# EasyEDA Pro project ProDoc_TP4056_2025-08-24.epro

# Schematic TP4056
Board Name: TP4056; Create Date: 2025-04-17; Page Name: TP4056; Project Name: TP4056_Module; Schematic Name: TP4056; Update Date: 2025-05-04; Add into BOM: yes; Convert to PCB: yes; Date: 2019-01-10; Draw By: Little_Arc; REV: 1.0; Sheet: 1/1; spicePre: .
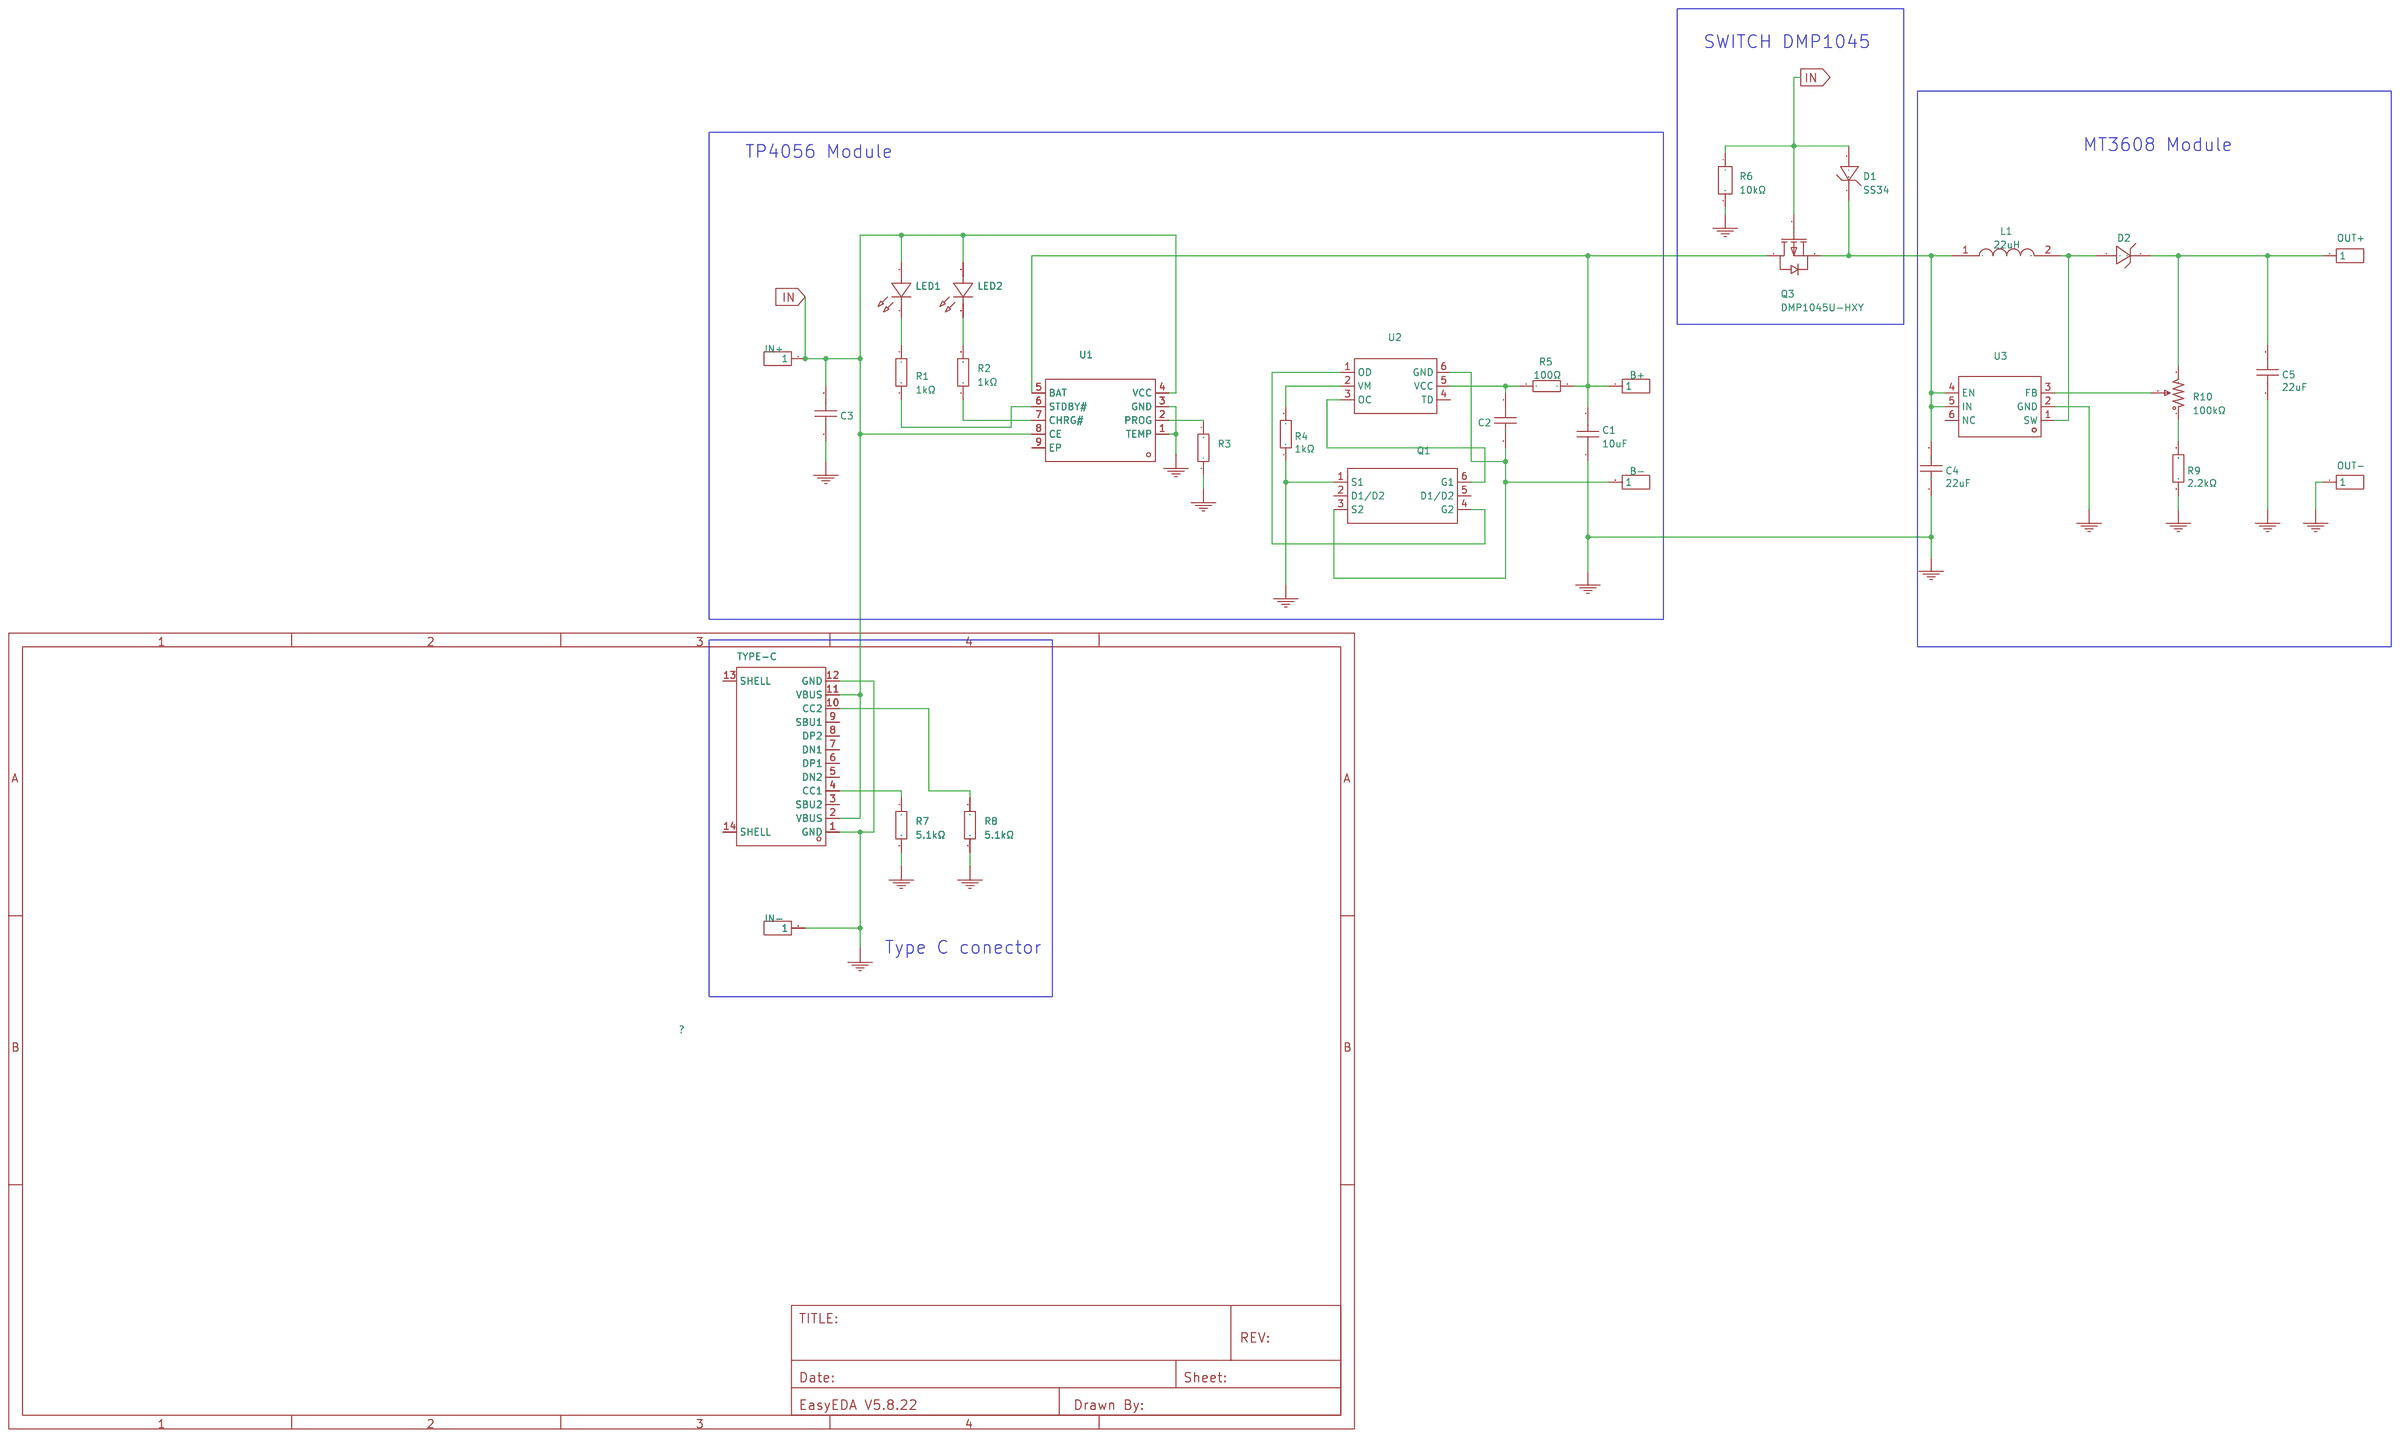
[diagram p0: schematic sheet]

## Parts
B+  Header-Male-2.54_1x1  [HDR-1X1/2.54]
B-  Header-Male-2.54_1x1  [HDR-1X1/2.54]
C1  10uF  [C0603]
C2  100nF  [C0603]
C3  100nF  [C0603]
C4  22uF  [C1206]
C5  22uF  [C1206]
D1  SS34  [SMB_L4.3-W3.6-LS5.3-RD]
D2  SS34  [SMB_L4.3-W3.6-LS5.3-RD]
IN+  Header-Male-2.54_1x1  [HDR-1X1/2.54]
IN-  Header-Male-2.54_1x1  [HDR-1X1/2.54]
L1  22uH  [IND-SMD_L7.8-W7.0_GCD75]
LED1  A-SP192DGHC-C01-4T  [LED0603-FD]
LED2  XL-1608SURC-06  [LED0603-RD_RED]
OUT+  Header-Male-2.54_1x1  [HDR-1X1/2.54]
OUT-  Header-Male-2.54_1x1  [HDR-1X1/2.54]
Q1  FS8205A  [SOT-23-6_L2.9-W1.6-P0.95-LS2.8-BR]
Q3  DMP1045U-HXY  [SOT-23-3_L2.9-W1.5-P1.90-LS2.6-BR]
R1  1kΩ  [R0603]
R2  1kΩ  [R0603]
R3  1.2kΩ  [R0603]
R4  1kΩ  [R0603]
R5  100Ω  [R0402]
R6  10kΩ  [R0603]
R7  5.1kΩ  [R0603]
R8  5.1kΩ  [R0603]
R9  2.2kΩ  [R0603]
R10  100kΩ  [RES-ADJ-TH_3296P]
TYPE-C  TYPE-C 16PIN 2MD(073)  [USB-C-SMD_TYPE-C-6PIN-2MD-073]
U1  TP4056  [ESOP-8_L4.9-W3.9-P1.27-LS6.0-BL-EP]
U2  DW01A  [SOT-23-6_L2.9-W1.6-P0.95-LS2.8-BL]
U3  MT3608  [SOT-23-6_L2.9-W1.6-P0.95-LS2.8-BL]

## Library data of the parts
B+ B- IN+ IN- OUT+ OUT- = Header-Male-2.54_1x1: Supplier Part: C81276; Supplier: LCSC; Manufacturer: ReliaPro; spicePre: P
C1 = 0603X106K100CT: Capacitance:10uF Tolerance:±10% Tolerance:±10% Voltage Rating:- Temperature Coefficient:X5R; LCSC Part Name: 10uF ±10%; Supplier Part: C2840513; Manufacturer: Walsin(华新科); Supplier Footprint: 0603; JLCPCB Part Class: Extended Part; Datasheet: https://atta.szlcsc.com/upload/public/pdf/source/20210707/C2840513_FC43A2A62BF29FBE407BBABA9C1F0793.pdf; Supplier: LCSC; Tolerance: ±10%; Temperature Coefficient: X5R
C2 C3 = CC0603KRX7R9BB104: Capacitance: Tolerance:±10% Tolerance:±10% Voltage Rated: Temperature Coefficient:; LCSC Part Name: 100nF ±10% 50V; Supplier Part: C14663; Manufacturer: YAGEO(国巨); Supplier Footprint: 0603; JLCPCB Part Class: Basic Part; Datasheet: https://atta.szlcsc.com/upload/public/pdf/source/20180910/C282072_33301C7F631E79921B82A8DAC6BCC5B3.pdf; Supplier: LCSC; Tolerance: ±10%
C4 C5 = C1206X6S226M250NT: Capacitance:22uF Voltage Rating:25V Temperature Coefficient:-; LCSC Part Name: 22uF 25V; Supplier Part: C2835562; Manufacturer: SANYEAR(叁叶源); Supplier Footprint: 1206; JLCPCB Part Class: Extended Part; Datasheet: https://atta.szlcsc.com/upload/public/pdf/source/20211010/C2835566_14A0738C7D65B521DA1087F759FD87A4.pdf; Supplier: LCSC; Voltage Rating: 25V
D1 D2 = SS34_C3040628: Supplier Part: C3040628; Manufacturer: TECH PUBLIC(台舟); Supplier Footprint: SMA(DO-214AC); JLCPCB Part Class: Extended Part; Datasheet: https://atta.szlcsc.com/upload/public/pdf/source/20220721/42DFBCCF71D5E6F935D4D44D6D405D19.pdf; Supplier: LCSC
L1 = CY75-22UH: Inductance: Tolerance:±10% Tolerance:±10% Rated Current: Saturation Current (Isat):- DC Resistance (DCR): Q @ Freq:- Frequency - Self Resonant:- Ratings:; LCSC Part Name: 22uH ±10%; Supplier Part: C2929439; Manufacturer: SHOU HAN(首韩); Supplier Footprint: SMD,7.8x7mm; JLCPCB Part Class: Extended Part; Datasheet: https://atta.szlcsc.com/upload/public/pdf/source/20211213/9D59673C46388054D2E0A5C760F25837.pdf; Supplier: LCSC; Tolerance: ±10%
LED1 = A-SP192DGHC-C01-4T: Emitted Color:Green Forward Voltage (VF):2.4V~3V Forward Voltage (VF):2.4V~3V Power Dissipation:70mW Dominant Wavelength:520nm~535nm Dominant Wavelength:520nm~535nm Lens Color:Colorless Transparent Lens Luminous Intensity:225mcd~450mcd Luminous Intensity:; LCSC Part Name: 0603高亮绿灯正贴; Supplier Part: C19171301; Manufacturer: Amicc(欧密格光电); Supplier Footprint: 0603; JLCPCB Part Class: Extended Part; Datasheet: https://atta.szlcsc.com/upload/public/pdf/source/20231108/CAA90604E374CB6B31BBE970B55159E7.pdf; Supplier: LCSC; Emitted Color: Green; Forward Voltage (VF): 2.4V~3V; Power Dissipation: 70mW; Dominant Wavelength: 520nm~535nm; Lens Color: Colorless Transparent Lens; Luminous Intensity: 225mcd~450mcd; Viewing Angle: 120°; Mounting Sytle: Positive Stick; Operating Temperature: -40℃~+85℃
LED2 = XL-1608SURC-06: Lamp Holder Type:- Illumination Color:Red Voltage - Forward(Vf):2.3V Voltage - Forward(Vf):2.3V Power(Watts):50mW Forward Current:20mA Wavelength - Dominant:620nm~630nm Wavelength - Dominant:620nm~630nm Peak Wavelength:625nm Diode Configuration:- Lens Col; Supplier Part: C965799; Manufacturer: XINGLIGHT(成兴光); Supplier Footprint: 0603; JLCPCB Part Class: Extended Part; Datasheet: https://atta.szlcsc.com/upload/public/pdf/source/20250213/F9766CE804AF391355DCDD48DB3E0DAB.pdf; Supplier: LCSC; Illumination Color: Red; Voltage - Forward(Vf): 2.3V; Power(Watts): 50mW; Forward Current: 20mA; Wavelength - Dominant: 620nm~630nm; Peak Wavelength: 625nm; Lens Color: Colorless Transparent Lens; Luminous Intensity: 225mcd; Viewing Angle: 120°; Mounting Sytle: Positive Stick; Operating Temperature: -20℃~+85℃
Q1 = FS8205A_C908265: Type:2 N-Channel Drain to Source Voltage:20V Current - Continuous Drain(Id): RDS(on):18mΩ@4.5V,6A Pd - Power Dissipation:1.5W Gate Threshold Voltage (Vgs(th)@Id):1.2V Gate Charge(Qg):11nC@4.5V Input Capacitance(Ciss@Vds):800pF@8V Reverse Transfer Capacita; LCSC Part Name: 2个N沟道 耐压:20V 电流:6A; Supplier Part: C908265; Manufacturer: FUXINSEMI(富芯森美); Supplier Footprint: SOT-23-6L; JLCPCB Part Class: Extended Part; Datasheet: https://atta.szlcsc.com/upload/public/pdf/source/20201027/C908265_C6F1A5E0FB14735EF799FEF607A99450.pdf; Supplier: LCSC; Type: 2 N-Channel; Drain to Source Voltage: 20V; RDS(on): 18mΩ@4.5V,6A; Pd - Power Dissipation: 1.5W; Gate Threshold Voltage (Vgs(th)@Id): 1.2V; Gate Charge(Qg): 11nC@4.5V; Input Capacitance(Ciss@Vds): 800pF@8V; Reverse Transfer Capacitance (Crss@Vds): 125pF@8V; Operating Temperature: -55℃~+150℃@(Tj)
Q3 = DMP1045U-HXY: Type:1 piece P-channel Drain to Source Voltage:20V Current - Continuous Drain(Id):5A RDS(on):-; LCSC Part Name: 1个P沟道 耐压:20V 电流:5A; Supplier Part: C22366440; Manufacturer: HXY MOSFET(华轩阳电子); Supplier Footprint: SOT-23; JLCPCB Part Class: Extended Part; Datasheet: https://atta.szlcsc.com/upload/public/pdf/source/20240325/BFE8E9B09D2639D7EAC9A471C7F13AD0.pdf; Supplier: LCSC; Type: 1 piece P-channel; Drain to Source Voltage: 20V; Current - Continuous Drain(Id): 5A
R1 R2 R4 = RC0603FR-071KL: Type:Thick Film Resistors Resistance: Tolerance:±1% Tolerance:±1% Power(Watts): Overload Voltage (Max): Temperature Coefficient:±100ppm/℃ Temperature Coefficient:±100ppm/℃ Operating Temperature Range:-55℃~+155℃ Operating Temperature Range:-55℃~+155℃; LCSC Part Name: 厚膜电阻 1kΩ ±1% 100mW; Supplier Part: C22548; Manufacturer: YAGEO(国巨); Supplier Footprint: 0603; JLCPCB Part Class: Extended Part; Datasheet: https://atta.szlcsc.com/upload/public/pdf/source/20180316/70C0E2BDAE7FCC62C531A5A58D202EE1.pdf; Supplier: LCSC; Type: Thick Film Resistors; Tolerance: ±1%; Temperature Coefficient: ±100ppm/℃; Operating Temperature Range: -55℃~+155℃
R3 = RMC06031.2K5%N: Resistance: Tolerance:±5% Tolerance:±5% Power(Watts):; LCSC Part Name: 1.2kΩ ±5% 100mW; Supplier Part: C269681; Manufacturer: Tyohm(幸亚电阻); Supplier Footprint: 0603; JLCPCB Part Class: Extended Part; Datasheet: https://atta.szlcsc.com/upload/public/pdf/source/20190115/C325956_D27151D492FFB3C9AB4A6F14FE01F30A.pdf; Supplier: LCSC; Tolerance: ±5%
R5 = TR0402B100RQ1050Z: Type:Thin Film Resistor Resistance: Tolerance:±0.1% Tolerance:±0.1% Power(Watts): Overload Voltage (Max): Temperature Coefficient:±50ppm/℃ Temperature Coefficient:±50ppm/℃ Operating Temperature Range:-55℃~+155℃ Operating Temperature Range:-55℃~+155℃; LCSC Part Name: 薄膜电阻 100Ω ±0.1% 63mW; Supplier Part: C332259; Manufacturer: EVER OHMS(天二科技); Supplier Footprint: 0402; JLCPCB Part Class: Extended Part; Datasheet: https://atta.szlcsc.com/upload/public/pdf/source/20190527/C149900_32B1354086E9F6A772108AB7B2B7A514.pdf; Supplier: LCSC; Type: Thin Film Resistor; Tolerance: ±0.1%; Temperature Coefficient: ±50ppm/℃; Operating Temperature Range: -55℃~+155℃
R6 = FRC0603J103 TS: Type:Thick Film Resistors Resistance:10kΩ Tolerance:±5% Tolerance:±5% Power(Watts):0.1W Voltage-Supply(Max):75V Temperature Coefficient:±100ppm/℃ Temperature Coefficient:±100ppm/℃ Operating Temperature:-55℃~+155℃ Operating Temperature:-55℃~+155℃; LCSC Part Name: 10kΩ ±5% 100mW 厚膜电阻; Supplier Part: C2930027; Manufacturer: FOJAN(富捷); Supplier Footprint: 0603; JLCPCB Part Class: Extended Part; Datasheet: https://atta.szlcsc.com/upload/public/pdf/source/20211221/925EC7D7225764EE0046F22065062C87.pdf; Supplier: LCSC; Type: Thick Film Resistors; Tolerance: ±5%; Power(Watts): 0.1W; Voltage-Supply(Max): 75V; Temperature Coefficient: ±100ppm/℃; Operating Temperature: -55℃~+155℃
R7 R8 = 0603WAF5101T5E: Type:Thick Film Resistors Resistance:5.1kΩ Tolerance:±1% Tolerance:±1% Power(Watts): Overload Voltage (Max): Temperature Coefficient:±100ppm/℃ Temperature Coefficient:±100ppm/℃ Operating Temperature Range:-55℃~+155℃ Operating Temperature Range:-55℃~+155℃; LCSC Part Name: 5.1kΩ ±1% 100mW 厚膜电阻; Supplier Part: C23186; Manufacturer: UNI-ROYAL(厚声); Supplier Footprint: 0603; JLCPCB Part Class: Basic Part; Datasheet: https://atta.szlcsc.com/upload/public/pdf/source/20200306/C422600_1E6D84923E4A46A82E41ADD87F860B5C.pdf; Supplier: LCSC; Type: Thick Film Resistors; Tolerance: ±1%; Temperature Coefficient: ±100ppm/℃; Operating Temperature Range: -55℃~+155℃
R9 = 0603WAF2201T5E_C4190: Type:Thick Film Resistors Resistance:2.2kΩ Tolerance:±1% Tolerance:±1% Power(Watts): Overload Voltage (Max): Temperature Coefficient:±100ppm/℃ Temperature Coefficient:±100ppm/℃ Operating Temperature Range:-55℃~+155℃ Operating Temperature Range:-55℃~+155℃; LCSC Part Name: 2.2kΩ ±1% 100mW 厚膜电阻; Supplier Part: C4190; Manufacturer: UNI-ROYAL(厚声); Manufacturer Part: 0603WAF2201T5E; Supplier Footprint: 0603; JLCPCB Part Class: Basic Part; Datasheet: https://atta.szlcsc.com/upload/public/pdf/source/20200306/C422600_1E6D84923E4A46A82E41ADD87F860B5C.pdf; Supplier: LCSC; Type: Thick Film Resistors; Tolerance: ±1%; Temperature Coefficient: ±100ppm/℃; Operating Temperature Range: -55℃~+155℃
R10 = 3296P-1-104LF: Resistance: Tolerance:±10% Tolerance:±10% Power(Watts):500mW Temperature Coefficient:±100ppm/℃ Temperature Coefficient:±100ppm/℃ Turns:; LCSC Part Name: 100kΩ ±10%; Supplier Part: C780112; Manufacturer: BOURNS; Supplier Footprint: 插件-3P,9.5x4.8mm; JLCPCB Part Class: Extended Part; Datasheet: https://atta.szlcsc.com/upload/public/pdf/source/20200907/C780107_B10DBBD0C4B43BFA1FDAF98D4F88F255.pdf; Supplier: LCSC; Tolerance: ±10%; Power(Watts): 500mW; Temperature Coefficient: ±100ppm/℃
TYPE-C = TYPE-C 16PIN 2MD(073): Connector Type:Type-C Standard:USB 3.1 Gender:Female Mounting Style:Horizontal attachment Number of Contacts:16P Number of Ports:1 Current Rating - Power (Max):5A Operating Temperature Range:-25℃~+85℃ Operating Temperature Range:-25℃~+85℃ Rated Voltage (M; LCSC Part Name: Type-C 母 卧贴; Supplier Part: C2765186; Manufacturer: SHOU HAN(首韩); Supplier Footprint: SMD; JLCPCB Part Class: Extended Part; Datasheet: https://atta.szlcsc.com/upload/public/pdf/source/20211123/39B17C16241EAC15C5E277BDA434118E.pdf; Supplier: LCSC; Connector Type: Type-C; Standard: USB 3.1; Gender: Female; Mounting Style: Horizontal attachment; Number of Contacts: 16P; Number of Ports: 1; Current Rating - Power (Max): 5A; Operating Temperature Range: -25℃~+85℃; Rated Voltage (Max): 5V; Connect-Disconnect Life: 5000 Cuts; Core Colour: Black
U1 = TP4056_C382139: The Chip Type:Linear charging chip Supply Voltage:4V~6V Supply Voltage:4V~6V Maximum Charge Current:1A Charging Saturation Voltage:4.2V Type of Battery:Lithium-ion/Polymer Number of Cells:1 Number of Cells:1 Operating Temperature:-40℃~+85℃ Operating Tempe; LCSC Part Name: 1A锂电池充电IC; Supplier Part: C382139; Manufacturer: TPOWER(天源); Supplier Footprint: ESOP-8; JLCPCB Part Class: Extended Part; Datasheet: https://atta.szlcsc.com/upload/public/pdf/source/20190327/C382139_EC85960E6FE3E26856C240C81751A184.pdf; Supplier: LCSC; The Chip Type: Linear charging chip; Supply Voltage: 4V~6V; Maximum Charge Current: 1A; Charging Saturation Voltage: 4.2V; Type of Battery: Lithium-ion/Polymer; Number of Cells: 1; Operating Temperature: -40℃~+85℃
U2 = DW01A_C351410: Supplier Part: C351410; Manufacturer: PUOLOP(迪浦); Supplier Footprint: SOT-23-6L; JLCPCB Part Class: Extended Part; Datasheet: https://atta.szlcsc.com/upload/public/pdf/source/20190109/C351410_3E9B9491D1909DF24C48D1B9CD871392.pdf; Supplier: LCSC
U3 = MT3608: Function:Boost type Output Type:Adjustable Input Voltage:2V~24V Input Voltage:2V~24V Output Voltage:28V Output Voltage:28V Output Current:2A Switching Frequency:1.2MHz Switching Frequency:1.2MHz Operating Temperature:-40℃~+85℃ Operating Temperature:-40℃~+; LCSC Part Name: 高效1.2MHz 2A升压转换器; Supplier Part: C84817; Manufacturer: 西安航天民芯; Supplier Footprint: SOT-23-6; JLCPCB Part Class: Extended Part; Datasheet: https://atta.szlcsc.com/upload/public/pdf/source/20161110/1478743351706.pdf; Supplier: LCSC; Function: Boost type; Output Type: Adjustable; Input Voltage: 2V~24V; Output Voltage: 28V; Output Current: 2A; Switching Frequency: 1.2MHz; Operating Temperature: -40℃~+85℃; Synchronous Rectification: No; Number of Outputs: 1; Topology: Boost; Quiescent Current (Iq): 200uA; Switch tube (built-in/external): Built-in

## Nets
GND: C1.1 C3.1 C4.1 C5.1 IN-.1 OUT-.1 Q1.1(S1) R3.2 R4.1 R6.2 R7.2 R8.2 R9.1 TYPE-C.1(GND) TYPE-C.12(GND) U1.1(TEMP) U1.3(GND) U3.2(GND)
VCC_DW01A: C2.1 R5.1 U2.5(VCC)
BAT+: B+.1 C1.2 Q3.3(D) R5.2 U1.5(BAT)
BAT-: B-.1 C2.2 Q1.3(S2) U2.6(GND)
CC1: R7.1 TYPE-C.4(CC1)
CC2: R8.1 TYPE-C.10(CC2)
CHRG: R2.1 U1.7(CHRG#)
FB: R10.2 U3.3(FB)
IN: C3.2 D1.2(A) IN+.1 LED1.2(A) LED2.2(A) Q3.1(G) R6.1 TYPE-C.2(VBUS) TYPE-C.11(VBUS) U1.4(VCC) U1.8(CE)
IN_MT3608: C4.2 D1.1(C) L1.1 Q3.2(S) U3.4(EN) U3.5(IN)
OC: Q1.6(G1) U2.3(OC)
OD: Q1.4(G2) U2.1(OD)
OUT+: C5.2 D2.1(C) OUT+.1 R10.3
PROG: R3.1 U1.2(PROG)
STDBY: R1.2 U1.6(STDBY#)
SW: D2.2(A) L1.2 U3.1(SW)
VM: R4.2 U2.2(VM)
$1N5: LED1.1(K) R1.1
$1N6: LED2.1(K) R2.2
$1N2970: R9.2 R10.1

Not connected (* = marked no-connect by the designer): Q1 2(D1/D2) 5(D1/D2); TYPE-C 3(SBU2) 5(DN2) 6(DP1) 7(DN1) 8(DP2) 9(SBU1) 13(SHELL) 14(SHELL); U1 9(EP); U2 4(TD); U3 6(NC)

## Notes on the sheet
- SWITCH DMP1045
- MT3608 Module
- TP4056 Module
- Type C conector

# Board TP4056
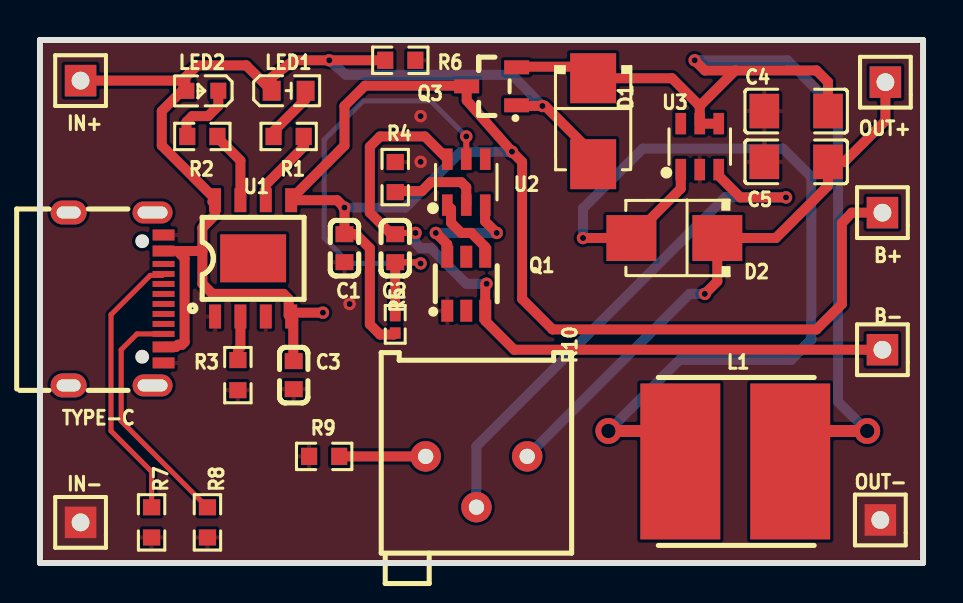
[diagram p1: board, top side]
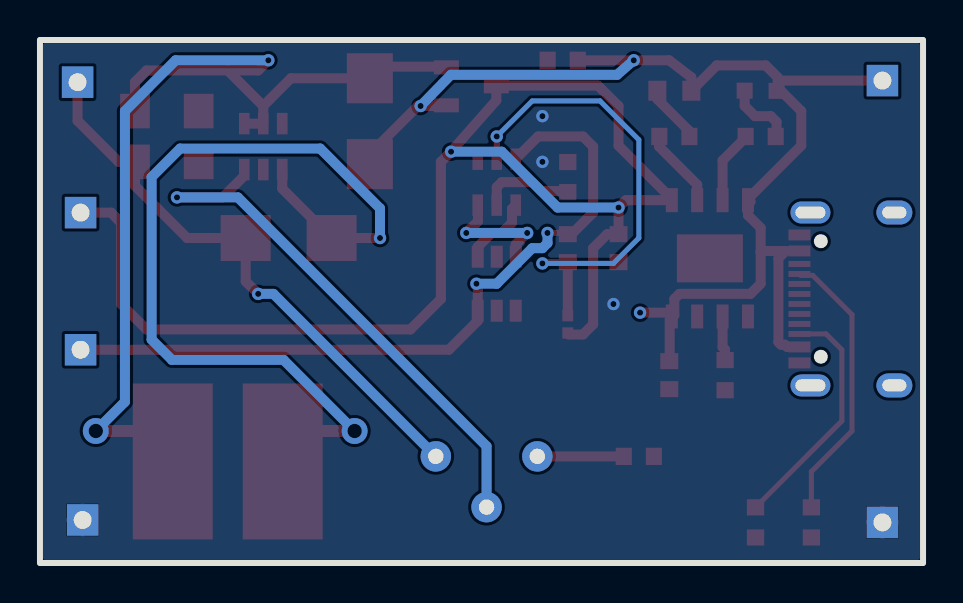
[diagram p2: board, bottom side, seen from below]

Outline 44.2 x 26.16 mm; copper layers: Top Layer, Bottom Layer. Coordinates in mm from the lower left corner of the outline.
Outline path: 0,26.16 44.2,26.16 44.2,0 0,0 0,26.16
Stack: Top Layer 0.035mm / Dielectric1 1.51mm FR4 er 4.5 / Bottom Layer 0.035mm

## Design rules (mm)
spacing Default (default): track to track 0.152, other pairs 0 to 0.152
track width Default (default): min 0.152, default 0.152, max 25.4
differential pair differentialPair (default): width min 0.127, default 0.254, max 2.54; gap min 0.152, default 0.152
via Default (default): diameter min 0.61, default 0.61, max 100.025; hole min 0.305, default 0.305, max 59.995
pour e100 uses (1)

## Placement (name value [footprint] x y rotation side)
B+  Header-Male-2.54_1x1  [HDR-1X1/2.54]  42.16 17.53 0 top
B-  Header-Male-2.54_1x1  [HDR-1X1/2.54]  42.16 10.67 0 top
C1  10uF  [C0603]  15.24 15.75 90 top
C2  100nF  [C0603]  17.78 15.75 90 top
C3  100nF  [C0603]  12.7 9.4 90 top
C4  22uF  [C1206]  37.85 22.61 0 top
C5  22uF  [C1206]  37.85 20.07 0 top
D1  SS34  [SMB_L4.3-W3.6-LS5.3-RD]  27.69 22.1 270 top
D2  SS34  [SMB_L4.3-W3.6-LS5.3-RD]  31.75 16.26 180 top
IN+  Header-Male-2.54_1x1  [HDR-1X1/2.54]  2.03 24.13 0 top
IN-  Header-Male-2.54_1x1  [HDR-1X1/2.54]  2.03 2.03 0 top
L1  22uH  [IND-SMD_L7.8-W7.0_GCD75]  34.8 5.08 180 top
LED1  A-SP192DGHC-C01-4T  [LED0603-FD]  12.45 23.62 180 top
LED2  XL-1608SURC-06  [LED0603-RD_RED]  8.13 23.62 180 top
OUT+  Header-Male-2.54_1x1  [HDR-1X1/2.54]  42.31 24.05 0 top
OUT-  Header-Male-2.54_1x1  [HDR-1X1/2.54]  42.06 2.15 0 top
Q1  FS8205A  [SOT-23-6_L2.9-W1.6-P0.95-LS2.8-BR]  21.34 13.97 270 top
Q3  DMP1045U-HXY  [SOT-23-3_L2.9-W1.5-P1.90-LS2.6-BR]  22.61 23.84 0 top
R1  1kΩ  [R0603]  12.45 21.34 0 top
R2  1kΩ  [R0603]  8.13 21.34 180 top
R3  1.2kΩ  [R0603]  9.91 9.4 270 top
R4  1kΩ  [R0603]  17.78 19.3 270 top
R5  100Ω  [R0402]  17.78 11.94 270 top
R6  10kΩ  [R0603]  18.03 25.15 0 top
R7  5.1kΩ  [R0603]  5.59 2.03 270 top
R8  5.1kΩ  [R0603]  8.38 2.03 270 top
R9  2.2kΩ  [R0603]  14.22 5.33 0 top
R10  100kΩ  [RES-ADJ-TH_3296P]  21.84 4.06 270 top
TYPE-C  TYPE-C 16PIN 2MD(073)  [USB-C-SMD_TYPE-C-6PIN-2MD-073]  3.81 13.21 270 top
U1  TP4056  [ESOP-8_L4.9-W3.9-P1.27-LS6.0-BL-EP]  10.67 15.24 0 top
U2  DW01A  [SOT-23-6_L2.9-W1.6-P0.95-LS2.8-BL]  21.34 19.05 0 top
U3  MT3608  [SOT-23-6_L2.9-W1.6-P0.95-LS2.8-BL]  33.02 20.83 0 top

## Footprints (pads in the part's own frame, mm; a bottom-side part is the same pattern mirrored in y, then rotated)
C0603
  rect 0.8x0.9 smd: 1(-0.7,0) 2(0.7,0)
C1206
  rect 1.485x1.728 smd: 1(-1.593,0) 2(1.593,0)
ESOP-8_L4.9-W3.9-P1.27-LS6.0-BL-EP
  rect 0.6x1.2 smd: 1(-1.905,-2.909) 2(-0.635,-2.909) 3(0.635,-2.909) 4(1.905,-2.909) 5(1.905,2.909) 6(0.635,2.909) 7(-0.635,2.909) 8(-1.905,2.909)
  rect 3.3x2.4 smd: 9(0,0)
HDR-1X1/2.54
  rect 1.575x1.575 hole 0.889: 1(0,0)
IND-SMD_L7.8-W7.0_GCD75
  rect 4x7.8 smd: 1(-2.75,0) 2(2.75,0)
LED0603-FD
  rect 0.9x1 smd: 1(-0.85,0) 2(0.85,0)
LED0603-RD_RED
  rect 0.8x0.8 smd: 1(-0.799,-0.004) 2(0.799,0.004)
R0402
  rect 0.566x0.54 smd: 1(-0.433,0) 2(0.433,0)
R0603
  rect 0.806x0.864 smd: 1(-0.753,0) 2(0.753,0)
RES-ADJ-TH_3296P
  round 1.524 hole 0.762: 1(-1.27,-2.54) 2(1.27,0) 3(-1.27,2.54)
SMB_L4.3-W3.6-LS5.3-RD
  rect 2.5x2.3 smd: 1(-2.15,0) 2(2.15,0)
SOT-23-3_L2.9-W1.5-P1.90-LS2.6-BR
  rect 1.25x0.7 smd: 1(1.25,-0.95) 2(1.25,0.95) 3(-1.25,0)
SOT-23-6_L2.9-W1.6-P0.95-LS2.8-BL
  rect 0.532x1.072 smd: 1(-0.95,-1.149) 2(0,-1.149) 3(0.95,-1.149) 4(0.95,1.149) 5(0,1.149) 6(-0.95,1.149)
SOT-23-6_L2.9-W1.6-P0.95-LS2.8-BR
  rect 1.1x0.6 smd: 1(1.35,-0.95) 2(1.35,0) 3(1.35,0.95) 4(-1.35,0.95) 5(-1.35,0) 6(-1.35,-0.95)
USB-C-SMD_TYPE-C-6PIN-2MD-073
  rect 0.55x1.1 smd: 1(-3.2,2.375) 2(-2.4,2.375) 11(2.4,2.375) 12(3.2,2.375)
  rect 0.3x1.1 smd: 3(-1.75,2.375) 4(-1.25,2.375) 5(-0.75,2.375) 6(-0.25,2.375) 7(0.25,2.375) 8(0.75,2.375) 9(1.25,2.375) 10(1.75,2.375)
  oval 1.1x2 hole 0.6x1.5: 13(-4.325,1.825) 14(4.325,1.825)
  oval 1.2x1.8 hole 0.6x1.2: 13(-4.325,-2.375) 14(4.325,-2.375)

## Nets
As in the schematic.

Pads without a net: Q1 2 5; TYPE-C 3 5 6 7 8 9 13 14; U1 9; U2 4; U3 6

## Via types
v1: diameter 0.62, hole 0.305, Top Layer to Bottom Layer, 18 vias
v2: diameter 1.3, hole 0.72, Top Layer to Bottom Layer, 2 vias

## Routing (per net, layer and track width the routed paths; a pad name or vN(x,y) marks a point on that pad's centre or on a via; arc(x,y) is an arc through that point)
GND:
  vias: v1(15.49,12.95) v1(19.05,22.35) v1(19.05,20.07)
VCC_DW01A: length 24
  Top Layer w0.3: v1(21.34,21.34) 21.34,20.21 ; C2.1 18.99,15.05 v1(19.05,14.99)
  Top Layer w0.5: C2.1 R5.1
  Bottom Layer w0.254: v1(19.05,14.99) 15.49,14.99 14.22,16.26 14.22,21.17 16.17,23.11 19.56,23.11 v1(21.34,21.34)
BAT+: length 68
  Top Layer w0.5: 12.57,18.21 15.24,20.88 15.24,22.86 16.27,23.88 21.36,23.88 ; U1.5 14.87,18.15 v1(15.24,17.78) C1.2 15.81,16.45 16.51,15.75 16.51,11.94 17.02,11.43 17.72,11.43 17.78,11.49 ; Q3.3 21.36,23.14 v1(23.62,20.57) 24.13,20.07 24.13,13.21 25.65,11.68 38.86,11.68 40.13,12.95 40.13,16.99 40.63,17.53 B+.1
  Bottom Layer w0.5: v1(23.62,20.57) 21.08,20.57 18.29,17.78 v1(15.24,17.78)
BAT-: length 37.9
  Top Layer w0.3: v1(18.8,16.51) 17.84,16.51 C2.2
  Top Layer w0.5: v1(22.35,13.97) 22.28,13.9 22.29,12.11 23.73,10.67 B-.1 ; 20.4,20.21 19.27,21.34 17.02,21.34 16.51,20.83 16.51,17.53 17.59,16.45 C2.2
  Bottom Layer w0.5: v1(18.8,16.51) 18.8,16 19.05,15.75 19.56,15.75 21.34,13.97 v1(22.35,13.97)
CC1: length 14
  Top Layer w0.254: TYPE-C.4 6.11,14.39 5.52,14.39 3.56,12.42 3.56,6.6 5.59,4.57 R7.1
CC2: length 12.1
  Top Layer w0.254: TYPE-C.10 4.85,11.46 4.06,10.67 4.06,7.1 R8.1
CHRG: length 3.6
  Top Layer w0.5: 10.03,18.21 10.03,20.13 8.83,21.34
FB: length 27.4
  Top Layer w0.5: 34.04,19.3 35.05,18.29 37.34,18.29
  Bottom Layer w0.5: R10.2 21.84,5.84 34.29,18.29 37.34,18.29
  vias: v1(37.34,18.29)
IN: length 62.5
  Top Layer w0.254: 6.87,15.61 TYPE-C.2
  Top Layer w0.5: v1(14.16,12.52) 12.57,12.52 ; 23.88,22.86 v1(25.15,22.86) 25.28,22.86 27.69,20.46 ; TYPE-C.11 6.8,10.81 6.92,10.92 7.11,10.92 7.24,11.05 7.24,15.24 6.87,15.61 8.09,15.61 8.13,15.57 ; 2.29,24.13 7.02,24.13 ; 8.13,15.57 8.13,13.97 8.64,13.46 12.19,13.46 12.45,13.21 12.45,12.39 12.68,12.16 12.68,10.12 C3.2 ; 8.13,15.57 8.13,16.76 8.76,17.4 8.76,18.21 ; 8.63,18.07 8.76,18.21 ; 8.76,18.21 6.1,20.88 6.1,22.61 7.28,23.79 7.28,24.3 7.87,24.89 10.33,24.89 11.59,23.62 11.59,24.3 12.71,25.15 v1(14.48,25.15) R6.1
  Bottom Layer w0.5: v1(14.48,25.15) 15.31,24.42 23.63,24.42 v1(25.15,22.86)
IN_MT3608: length 52.2
  Top Layer w0.5: 33.02,22.86 31.63,24.25 D1.1 27.11,24.83 23.86,24.83 ; 33.02,22.86 34.8,24.64 ; 33.02,22.86 U3.5 U3.4 ; v1(32.77,25.15) 33.27,24.64 34.8,24.64 ; 34.8,24.64 38.86,24.64 39.44,24.06 C4.2
  Top Layer w0.6: L1.1 39.07,6.6 v2(41.4,6.6)
  Bottom Layer w0.5: v1(32.77,25.15) 37.4,25.15 39.94,22.61 39.94,8.06 v2(41.4,6.6)
OC: length 6.1
  Top Layer w0.5: 22.28,17.89 22.28,17.09 v1(22.86,16.51) ; v1(19.81,16.51) 20.39,15.94 Q1.6
  Bottom Layer w0.5: v1(19.81,16.51) v1(22.86,16.51)
OD: length 3.7
  Top Layer w0.5: Q1.4 22.29,15.81 21.59,16.51 21.08,16.51 20.57,17.02 20.57,17.72 20.4,17.89
OUT+: length 28.6
  Top Layer w0.5: 34.04,16.26 36.83,16.26 39.44,18.86 C5.2 40.26,20.07 42.31,22.12 OUT+.1 ; D2.1 33.9,14.09 v1(33.27,13.46)
  Bottom Layer w0.5: R10.3 32.51,13.46 v1(33.27,13.46)
PROG: length 2.2
  Top Layer w0.5: 9.91,10.1 9.91,10.67 10.03,10.8 10.03,12.27
STDBY: length 3.9
  Top Layer w0.5: 11.3,18.21 11.3,18.92 13.21,20.83 13.21,21.27 13.15,21.34
SW: length 46.1
  Top Layer w0.5: v1(27.18,16.26) D2.2 32.07,18.73 U3.1
  Top Layer w0.6: v2(28.45,6.6) 30.73,6.6 30.73,6.61 L1.2
  Bottom Layer w0.5: v1(27.18,16.26) 27.18,17.74 30.17,20.73 37.18,20.73 38.61,19.3 38.61,11.18 37.59,10.16 32,10.16 v2(28.45,6.6)
VM: length 4.7
  Top Layer w0.5: 21.34,17.89 21.34,18.8 21.08,19.05 19.56,19.05 19.11,18.6 17.78,18.6
$1N5: length 2.9
  Top Layer w0.5: 13.3,23.62 13.3,23.2 11.75,21.65 11.75,21.34
$1N2970: length 4.3
  Top Layer w0.5: R9.2 R10.1
$1N6: length 3.4
  Top Layer w0.5: 7.33,21.34 7.33,22.06 7.62,22.35 8.41,22.35 8.93,22.87 LED2.1

## Copper pours and planes (outline as drawn; the poured copper is in the pictures)
GND on Top Layer: 0,26.16 44.2,26.16 44.2,0 0,0
GND on Bottom Layer: 0,26.16 44.2,26.16 44.2,0 0,0
